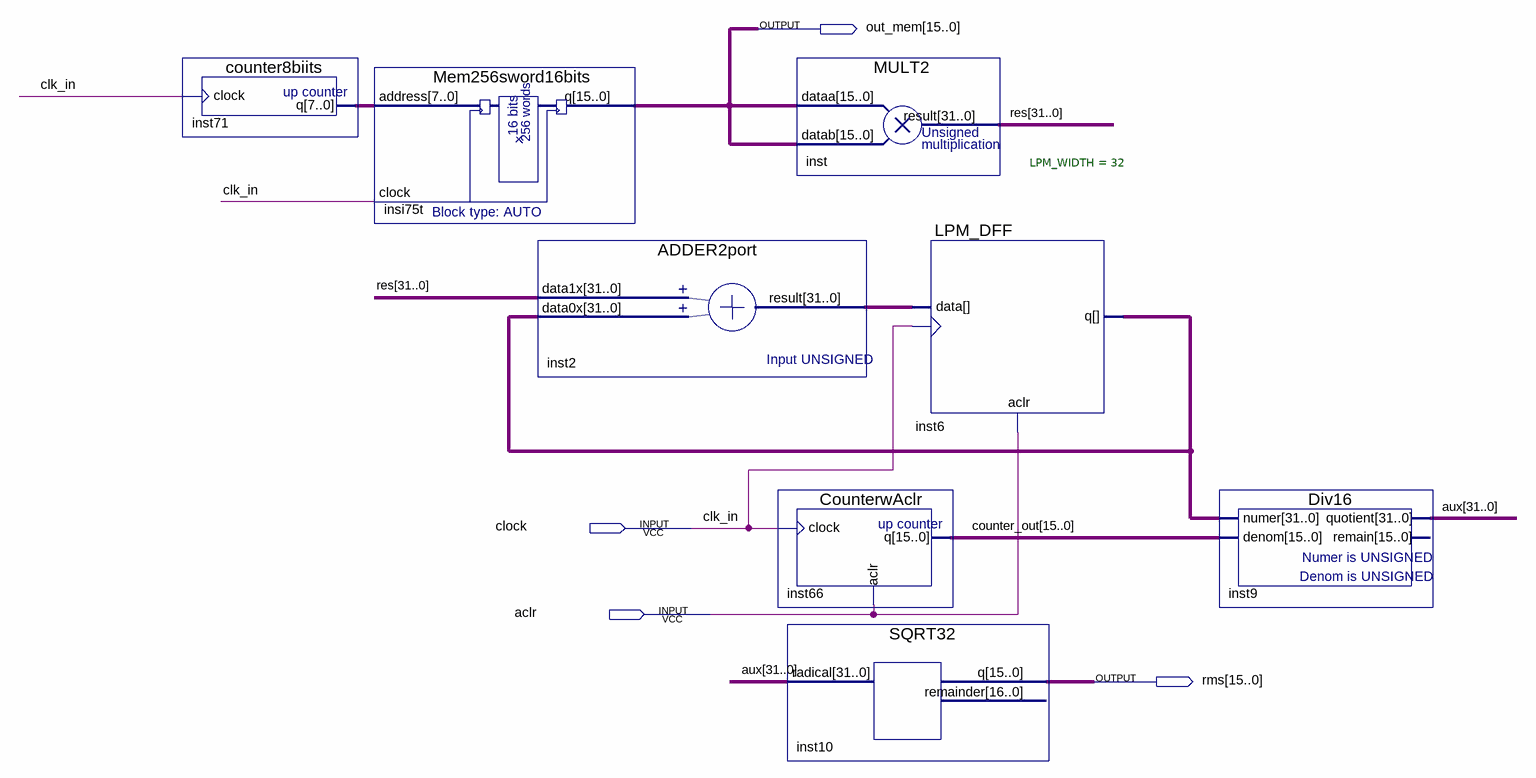
[diagram p0: schematic sheet]
// Quartus schematic Projeto2Aritim.bdf as structural Verilog: 8 symbols, 4 pins
module Projeto2Aritim (
  input  clock,
  input  aclr,
  output [15:0] out_mem,
  output [15:0] rms
);

  wire [7:0] inst71_q;
  wire [15:0] counter_out;
  wire [31:0] aux, inst2_result, inst6_q, res;

  counter8biits inst71 (.clock(clock), .q(inst71_q));
  Mem256sword16bits insi75t (.address(inst71_q), .clock(clock), .q(out_mem));
  ADDER2port inst2 (.data1x(res), .data0x(inst6_q), .result(inst2_result));
  CounterwAclr inst66 (.clock(clock), .aclr(aclr), .q(counter_out));
  SQRT32 inst10 (.radical(aux), .q(rms));  // open: remainder
  MULT2 inst (.dataa(out_mem), .datab(out_mem), .result(res));
  LPM_DFF #(.LPM_WIDTH(32)) inst6 (.aclr(aclr), .clock(clock), .data(inst2_result), .q(inst6_q));
  Div16 inst9 (.numer(inst6_q), .denom(counter_out), .quotient(aux));  // open: remain

  // Other names for the same wires on the sheet: clk_in = clock
endmodule
